# EAGLE schematic FT232-Breakout (EAGLE 6.5.0)
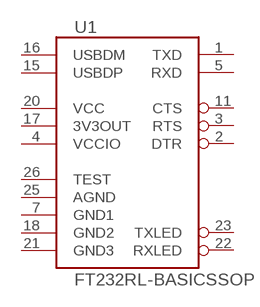
[diagram p0: schematic, sheet 1]

## Parts
U1  FT232RL-BASICSSOP  [SSOP28DB]
Unconnected: U1.1(TXD) U1.2(DTR) U1.3(RTS) U1.5(RXD) U1.11(CTS) U1.15(USBDP) U1.16(USBDM) U1.17(3V3OUT) U1.22(RXLED) U1.23(TXLED) U1.26(TEST)

## Power pins joined to a net without a drawn wire
AGND: U1.25(AGND)
GND1: U1.7(GND1)
GND2: U1.18(GND2)
GND3: U1.21(GND3)
VCC: U1.20(VCC)
VCCIO: U1.4(VCCIO)

## Library data of the parts
U1 = SparkFun-DigitalIC:FT232RL-BASIC: USB UART This is the simplified version of the FT232RL unit. Only what you need, nothing you don't. Spark Fun Electronics SKU : COM-00650